# Altium project Altium_Design_Challenge.PrjPcb (part 1 of 3)
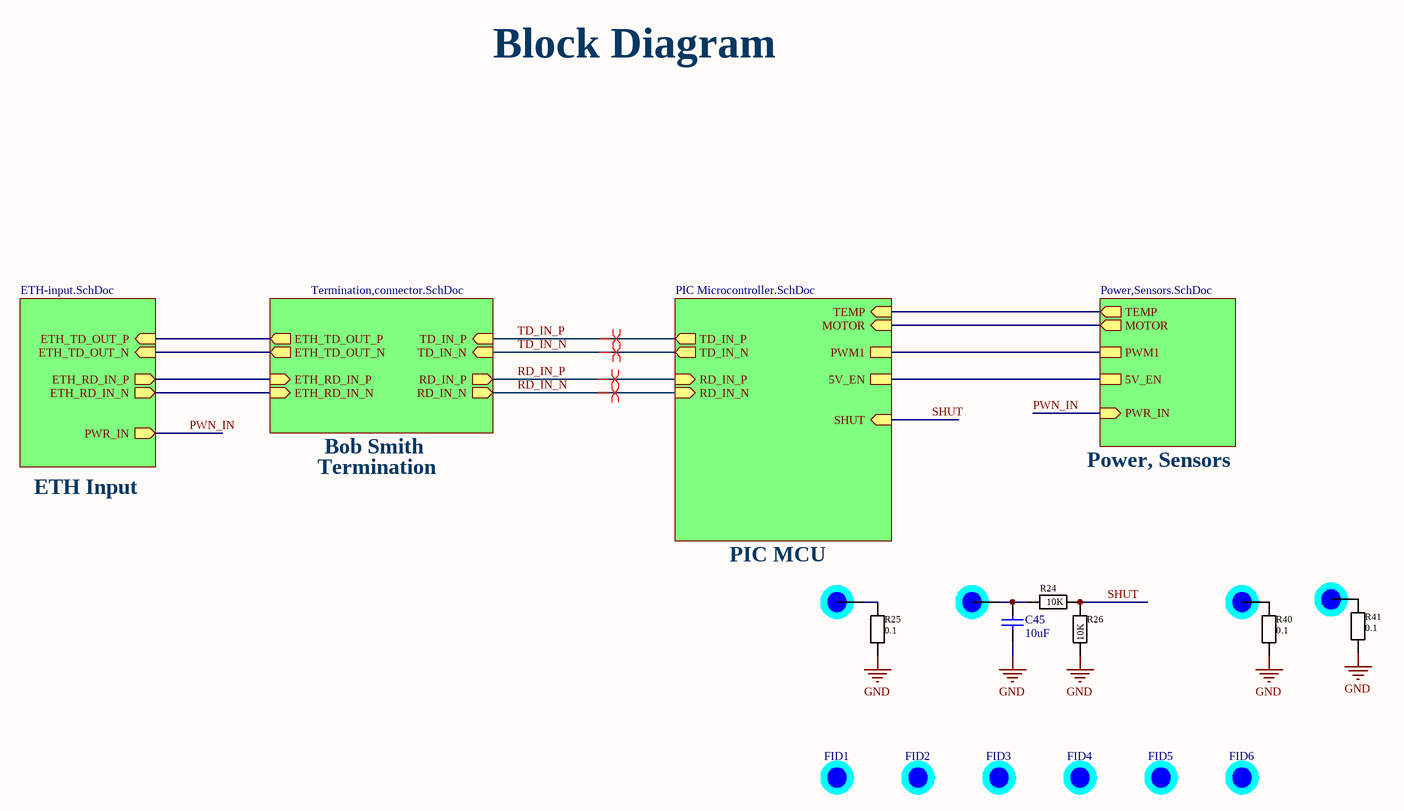
[diagram p0: Block Diagram.SchDoc]
5 sheets, 153 parts. Net scope: hierarchical (ports join the sheet entries above them; power ports are global).
Board file: AA-Design-Challenge_Muhammad.PcbDoc
Sheets:
  Block Diagram.SchDoc
    Designator = PIC Microcontroller.SchDoc
    Designator = Power,Sensors.SchDoc
    Designator = Termination,connector.SchDoc
    Designator = ETH-input.SchDoc

## Sheet Block Diagram.SchDoc: AA Design Challenge
size 431 x 279 mm; Revision: 1.0; SheetNumber: 1; SheetTotal: 4; ProjectName: TRK_GPRS_GNSS_BTLE

### Parts
C45  10uF  [CAPC1005X61USR]
FID1  Fiducial 1mm  [FIDUCIAL_1MM_RND]  (value not drawn)  (no BOM)
FID2  Fiducial 1mm  [FIDUCIAL_1MM_RND]  (value not drawn)  (no BOM)
FID3  Fiducial 1mm  [FIDUCIAL_1MM_RND]  (value not drawn)  (no BOM)
FID4  Fiducial 1mm  [FIDUCIAL_1MM_RND]  (value not drawn)  (no BOM)
FID5  Fiducial 1mm  [FIDUCIAL_1MM_RND]  (value not drawn)  (no BOM)
FID6  Fiducial 1mm  [FIDUCIAL_1MM_RND]  (value not drawn)  (no BOM)
MH1  MH_1.5mm  [MH_2mm]  (value not drawn)  (no BOM)
MH2  MH_1.5mm  [MH_2mm]  (value not drawn)  (no BOM)
MH3  MH_1.5mm  [MH_2mm]  (value not drawn)  (no BOM)
MH4  MH_1.5mm  [MH_2mm]  (value not drawn)  (no BOM)
R24  10K  [RESC1005X40USR]
R25  0.1  [RESC2012X65USR]
R26  10K  [RESC1005X40USR]
R40  0.1  [RESC2012X65USR]
R41  0.1  [RESC2012X65USR]

### Sub-sheets
Designator = PIC Microcontroller.SchDoc: TD_IN_P (out), TD_IN_N (out), RD_IN_P (in), RD_IN_N (in), TEMP (in), PWM1, 5V_EN, SHUT (in), MOTOR (in)
Designator = Power,Sensors.SchDoc: TEMP (out), PWM1, 5V_EN, MOTOR (out), PWR_IN (in)
Designator = Termination,connector.SchDoc: TD_IN_P (in), TD_IN_N (in), RD_IN_P (out), RD_IN_N (out), ETH_TD_OUT_P (out), ETH_TD_OUT_N (out), ETH_RD_IN_P (in), ETH_RD_IN_N (in)
Designator = ETH-input.SchDoc: ETH_TD_OUT_P (in), ETH_TD_OUT_N (in), ETH_RD_IN_P (out), ETH_RD_IN_N (out), PWR_IN (out)

### Nets
GND: C45.2 R25.1 R26.2 R40.1 R41.1
PWN_IN: sheet Designator/PWR_IN, sheet Designator/PWR_IN
RD_IN_N: sheet Designator/RD_IN_N, sheet Designator/RD_IN_N
RD_IN_P: sheet Designator/RD_IN_P, sheet Designator/RD_IN_P
RX_IN_N: sheet Designator/ETH_RD_IN_N, sheet Designator/ETH_RD_IN_N
RX_IN_P: sheet Designator/ETH_RD_IN_P, sheet Designator/ETH_RD_IN_P
SHUT: R24.2 R26.1 ; sheet Designator/SHUT
TD_IN_N: sheet Designator/TD_IN_N, sheet Designator/TD_IN_N
TD_IN_P: sheet Designator/TD_IN_P, sheet Designator/TD_IN_P
TX_IN_N: sheet Designator/ETH_TD_OUT_N, sheet Designator/ETH_TD_OUT_N
TX_IN_P: sheet Designator/ETH_TD_OUT_P, sheet Designator/ETH_TD_OUT_P
NetC21_2: sheet Designator/TEMP, sheet Designator/TEMP
NetC45_1: C45.1 MH2.1 R24.1
NetMH1_1: MH1.1 R25.2
NetMH3_1: MH3.1 R40.2
NetMH4_1: MH4.1 R41.2
NetR11_2: sheet Designator/PWM1, sheet Designator/PWM1
NetR13_1: sheet Designator/MOTOR, sheet Designator/MOTOR
NetR16_2: sheet Designator/5V_EN, sheet Designator/5V_EN

### Layout directives
differential pair: RD_IN_N, RD_IN_P, TD_IN_N, TD_IN_P

### Notes on the sheet
- Block Diagram
- Bob Smith
- ETH Input
- Termination
- Power, Sensors
- (near MH1) PIC MCU
- DWG. NO.
- REV.
- SHT.
- THIS DOCUMENT AND THE DATA DISCLOSED HEREIN OR HEREWITH IS THE PROPERTY OF ALTIUM LIMITED AND MAY BE FREELY DISTRIBUTED IN WHOLE. NO RIGHTS ARE RESERVED OR EXPRESS OR IMPLIED WARANTEE GIVEN.
- REVISION
- DESCRIPTION
- DATE
- APPROVED
- ENG:
- APPROVALS
- PROJECT
- DSN:
- CHK:
- REFERENCE DOCUMENTS
- PROJECT REVISION:
- TITLE
- DOCUMENT REVISION:
- DESIGN ITEM:
- BOM:
- FAB DWG:
- PCB DWG:
- ASSY DWG:
- SCALE:
- SIZE
- B
- CAGE CODE
- FILE NAME
- DWG NO.
- SHEET
- OF
- REV

### Library data of the parts
C45 = Cap: CAP CER 10UF 10V X5R 0402; Manufacturer: Samsung Electro-Mechanics; Manufacturer Part Number: CL05A106MP8NUB8; Supplier Part Number 1: 1276-6830-2-ND; Supplier Part Number 2: *; Supplier 1: *; Supplier 2: *; 100pc cost: *; 1pc cost: *; Height: *; value: 10uF
FID1-FID6 = FIDUCIAL_1MM_RND: Component Description: Fiducial 1mm
MH1-MH4 = MH_1.5mm: Component Description: Fiducial 1mm
R24 R26 = R: RES 10K OHM 1% 1/16W 0402; Manufacturer: Stackpole Electronics Inc; Manufacturer Part Number: RMCF0402FT10K0; Power Rating: 62.5mW; Tolerance: +/-1%; Voltage Rating: NA; Distributor: DigiKey; Value: 10K; Distributor Art. Nbr.: RMCF0402FT10K0TR-ND; Package: EIA-0402; Price Estim. @ 100pcs: 0.0049; Height: 0.40mm
R25 R40 R41 = R: RES 0.1 OHM 1% 1/8W 0805; Manufacturer: Yageo; Manufacturer Part Number: RL0805FR-070R1L; Tolerance: +/-1%; Voltage Rating: NA; Distributor: DigiKey; Value: 0.1; Distributor Art. Nbr.: 311-.10STR-ND; Package: EIA-0805; Height: 0.60mm

## Sheet PIC Microcontroller.SchDoc: AA Design Challenge
size 431 x 279 mm; Revision: 1.0; SheetNumber: 3; SheetTotal: 4; ProjectName: TRK_GPRS_GNSS_BTLE
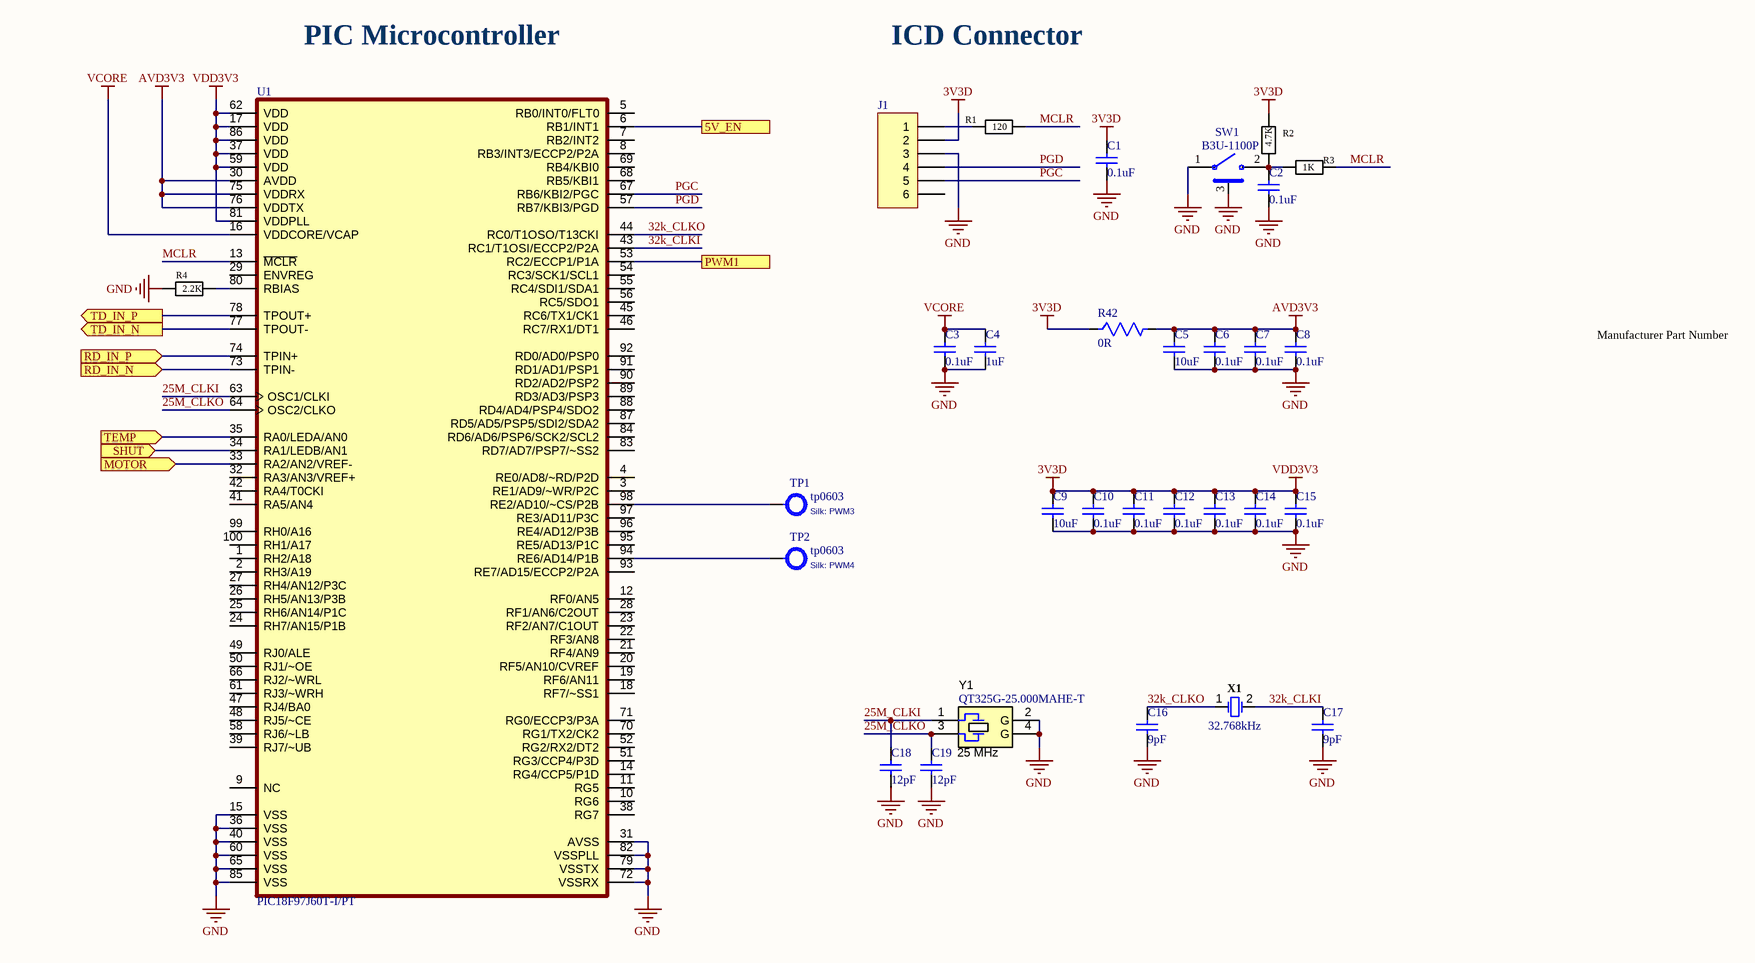
[diagram p1: PIC Microcontroller.SchDoc]

### Parts
C1  0.1uF  [CAPC1005X61USR]
C2  0.1uF  [CAPC1005X61USR]
C3  0.1uF  [CAPC1005X61USR]
C4  1uF  [CAPC1005X61USR]
C5  10uF  [CAPC1005X61USR]
C6  0.1uF  [CAPC1005X61USR]
C7  0.1uF  [CAPC1005X61USR]
C8  0.1uF  [CAPC1005X61USR]
C9  10uF  [CAPC1005X61USR]
C10  0.1uF  [CAPC1005X61USR]
C11  0.1uF  [CAPC1005X61USR]
C12  0.1uF  [CAPC1005X61USR]
C13  0.1uF  [CAPC1005X61USR]
C14  0.1uF  [CAPC1005X61USR]
C15  0.1uF  [CAPC1005X61USR]
C16  9pF  [CAPC1005X61USR]
C17  9pF  [CAPC1005X61USR]
C18  12pF  [CAPC1005X61USR]
C19  12pF  [CAPC1005X61USR]
J1  Header 6  [HDR1X6]  (value not drawn)  (no BOM)
R1  120  [RESC1005X40USR]
R2  4.7K  [RESC1005X40USR]
R3  1K  [RESC1005X40USR]
R4  2.2K  [RESC1005X40USR]
R42  0R  [R_0603]
SW1  B3U-1100P  [SW_B3U-1100P]
TP1  tp0603  Silk: PWM3  [TP 1mm]
TP2  tp0603  Silk: PWM4  [TP 1mm]
U1  PIC18F97J60T-I/PT  [QFP40P1400X1400X120-100N]
X1  32.768kHz  [XTAL_3215]
Y1  QT325G-25.000MAHE-T  Frequency_Fixed: 25 MHz  [XTAL_3225]

### Ports
5V_EN, MOTOR (in), PWM1, RD_IN_N (in), RD_IN_P (in), SHUT (in), TD_IN_N (out), TD_IN_P (out), TEMP (in)

### Nets
3V3D: C1.1 C9.1 C10.1 C11.1 C12.1 C13.1 C14.1 C15.1 J1.2 R2.1 R42.1 U1.17(VDD) U1.37(VDD) U1.59(VDD) U1.62(VDD) U1.81(VDDPLL) U1.86(VDD)  [also labelled VDD3V3]
AVD3V3: C5.1 C6.1 C7.1 C8.1 R42.2 U1.30(AVDD) U1.75(VDDRX) U1.76(VDDTX)
GND: C1.2 C2.2 C3.2 C4.1 C5.2 C6.2 C7.2 C8.2 C9.2 C10.2 C11.2 C12.2 C13.2 C14.2 C15.2 C16.2 C17.2 C18.2 C19.2 J1.3 R4.1 SW1.1 SW1.3 U1.15(VSS) U1.31(AVSS) U1.36(VSS) U1.40(VSS) U1.60(VSS) U1.65(VSS) U1.72(VSSRX) U1.79(VSSTX) U1.82(VSSPLL) U1.85(VSS) Y1.2(GND) Y1.4(GND)
VCORE: C3.1 C4.2 U1.16(VDDCORE/VCAP)
25M_CLKI: C18.1 U1.63(OSC1/CLKI) Y1.1
25M_CLKO: C19.1 U1.64(OSC2/CLKO) Y1.3
32k_CLKI: C17.1 U1.43(RC1/T1OSI/ECCP2/P2A) X1.2
32k_CLKO: C16.1 U1.44(RC0/T1OSO/T13CKI) X1.1
MCLR: R1.2 R3.2 U1.13(~{MCLR})
PGC: J1.5 U1.67(RB6/KBI2/PGC)
PGD: J1.4 U1.57(RB7/KBI3/PGD)
RD_IN_N: U1.73(TPIN-) ; port RD_IN_N
RD_IN_P: U1.74(TPIN+) ; port RD_IN_P
SHUT: U1.34(RA1/LEDB/AN1) ; port SHUT
TD_IN_N: U1.77(TPOUT-) ; port TD_IN_N
TD_IN_P: U1.78(TPOUT+) ; port TD_IN_P
NetC2_1: C2.1 R2.2 R3.1 SW1.2
NetC21_2: U1.35(RA0/LEDA/AN0) ; port TEMP
NetJ1_1: J1.1 R1.1
NetR4_2: R4.2 U1.80(RBIAS)
NetR11_2: U1.53(RC2/ECCP1/P1A) ; port PWM1
NetR13_1: U1.33(RA2/AN2/VREF-) ; port MOTOR
NetR16_2: U1.6(RB1/INT1) ; port 5V_EN
NetTP1_1: TP1.1 U1.98(RE2/AD10/~CS/P2B)
NetTP2_1: TP2.1 U1.94(RE6/AD14/P1B)

Not connected (* = marked no-connect by the designer): J1 6; U1 1(RH2/A18) 2(RH3/A19) 3(RE1/AD9/~WR/P2C) 4(RE0/AD8/~RD/P2D) 5(RB0/INT0/FLT0) 7(RB2/INT2) 8(RB3/INT3/ECCP2/P2A) 9(NC) 10(RG6) 11(RG5) 12(RF0/AN5) 14(RG4/CCP5/P1D) 18(RF7/~SS1) 19(RF6/AN11) 20(RF5/AN10/CVREF) 21(RF4/AN9) 22(RF3/AN8) 23(RF2/AN7/C1OUT) 24(RH7/AN15/P1B) 25(RH6/AN14/P1C) 26(RH5/AN13/P3B) 27(RH4/AN12/P3C) 28(RF1/AN6/C2OUT) 29(ENVREG) 32(RA3/AN3/VREF+) 38(RG7) 39(RJ7/~UB) 41(RA5/AN4) 42(RA4/T0CKI) 45(RC6/TX1/CK1) 46(RC7/RX1/DT1) 47(RJ4/BA0) 48(RJ5/~CE) 49(RJ0/ALE) 50(RJ1/~OE) 51(RG3/CCP4/P3D) 52(RG2/RX2/DT2) 54(RC3/SCK1/SCL1) 55(RC4/SDI1/SDA1) 56(RC5/SDO1) 58(RJ6/~LB) 61(RJ3/~WRH) 66(RJ2/~WRL) 68(RB5/KBI1) 69(RB4/KBI0) 70(RG1/TX2/CK2) 71(RG0/ECCP3/P3A) 83(RD7/AD7/PSP7/~SS2) 84(RD6/AD6/PSP6/SCK2/SCL2) 87(RD5/AD5/PSP5/SDI2/SDA2) 88(RD4/AD4/PSP4/SDO2) 89(RD3/AD3/PSP3) 90(RD2/AD2/PSP2) 91(RD1/AD1/PSP1) 92(RD0/AD0/PSP0) 93(RE7/AD15/ECCP2/P2A) 95(RE5/AD13/P1C) 96(RE4/AD12/P3B) 97(RE3/AD11/P3C) 99(RH0/A16) 100(RH1/A17)

### Notes on the sheet
- PIC Microcontroller
- ICD Connector
- Manufacturer Part Number
- DWG. NO.
- REV.
- SHT.
- THIS DOCUMENT AND THE DATA DISCLOSED HEREIN OR HEREWITH IS THE PROPERTY OF ALTIUM LIMITED AND MAY BE FREELY DISTRIBUTED IN WHOLE. NO RIGHTS ARE RESERVED OR EXPRESS OR IMPLIED WARANTEE GIVEN.
- REVISION
- DESCRIPTION
- DATE
- APPROVED
- ENG:
- APPROVALS
- PROJECT
- DSN:
- CHK:
- REFERENCE DOCUMENTS
- PROJECT REVISION:
- TITLE
- DOCUMENT REVISION:
- DESIGN ITEM:
- BOM:
- FAB DWG:
- PCB DWG:
- ASSY DWG:
- SCALE:
- SIZE
- B
- CAGE CODE
- FILE NAME
- DWG NO.
- SHEET
- OF
- REV
- (in symbol ABM8AIG-25.000MHZ-12-2Z-T3) G

### Library data of the parts
C1-C3 C6-C8 C10-C15 = Cap: CAP CER 0.1UF 50V X7R 0402; Manufacturer: TDK Corporation; Manufacturer Part Number: CGA2B3X7R1H104K050BB; Supplier Part Number 1: 445-6899-2-ND; Supplier Part Number 2: *; Supplier 1: *; Supplier 2: *; 100pc cost: *; 1pc cost: *; Height: *; value: 0.1uF
C4 = Cap: CAP CER 1UF 16V X5R 0402; Manufacturer: Samsung Electro-Mechanics; Manufacturer Part Number: CL05A105KO5NNNC; Supplier Part Number 1: 1276-1067-2-ND; Supplier Part Number 2: *; Supplier 1: *; Supplier 2: *; 100pc cost: *; 1pc cost: *; Height: *; value: 1uF
C5 C9 = Cap: as C45 on sheet Block Diagram; Supplier Part Number 1: 1276-6830-2-ND; Supplier Part Number 2: *; Supplier 1: *; Supplier 2: *; 100pc cost: *; 1pc cost: *; Height: *; value: 10uF
C16 C17 = Cap: CAP CER 9PF 50V C0G/NPO 0402; Manufacturer: Yageo; Manufacturer Part Number: CC0402BRNPO9BN9R0; Supplier Part Number 1: 311-1629-2-ND; Supplier Part Number 2: *; Supplier 1: *; Supplier 2: *; 100pc cost: *; 1pc cost: *; Height: *; value: 9pF
C18 C19 = Cap: CAP CER 12PF 50V C0G 0402; Manufacturer: TDK Corporation; Manufacturer Part Number: CGA2B2C0G1H120J050BA; Supplier Part Number 1: 445-5585-2-ND; Supplier Part Number 2: *; Supplier 1: *; Supplier 2: *; 100pc cost: *; 1pc cost: *; Height: *; value: 12pF
J1 = Header 6: Header, 6-Pin; LatestRevisionDate: 17-Jul-2002; LatestRevisionNote: Re-released for DXP Platform.; Publisher: Altium Limited
R1 = R: RES SMD 120 OHM 1% 1/16W 0402; Manufacturer: Yageo; Manufacturer Part Number: RC0402FR-07120RL; Power Rating: 62.5mW; Tolerance: +/-1%; Voltage Rating: NA; Distributor: DigiKey; Value: 120; Distributor Art. Nbr.: 311-120LRTR-ND; Package: EIA-0402; Price Estim. @ 100pcs: 0.0049; Height: 0.40mm
R2 = R: RES SMD 4.7K OHM 1% 1/16W 0402; Manufacturer: Yageo; Manufacturer Part Number: RC0402FR-074K7L; Power Rating: 62.5mW; Tolerance: +/-1%; Voltage Rating: NA; Distributor: DigiKey; Value: 4.7K; Distributor Art. Nbr.: 311-4.7KLRTR-ND; Package: EIA-0402; Price Estim. @ 100pcs: 0.0049; Height: 0.40mm
R3 = R: RES SMD 1K OHM 1% 1/16W 0402; Manufacturer: Yageo; Manufacturer Part Number: RC0402FR-071KL; Power Rating: 62.5mW; Tolerance: +/-1%; Voltage Rating: NA; Distributor: DigiKey; Value: 1K; Distributor Art. Nbr.: 311-1.00KLRTR-ND; Package: EIA-0402; Price Estim. @ 100pcs: 0.0049; Height: 0.40mm
R4 = R: RES SMD 2.2K OHM 1% 1/16W 0402; Manufacturer: Yageo; Manufacturer Part Number: RC0402FR-072K2L; Power Rating: 62.5mW; Tolerance: +/-1%; Voltage Rating: NA; Distributor: DigiKey; Value: 2.2K; Distributor Art. Nbr.: 311-2.20KLRTR-ND; Package: EIA-0402; Price Estim. @ 100pcs: 0.0049; Height: 0.40mm
R42 = Res 0R 1/10W 0603: Fixed Resistor, Metal Glaze/thick Film, 0.1W, 0ohm, Surface Mount, 0603; Manufacturer: Yageo; Manufacturer Part Number: RC0603FR-070RL; Rated Power Dissipation (P): 100mW; Rated Temperature: 70°C; Supplier 1: Mouser; Supplier Part Number 1: 603-RC0603FR-070RL; RoHS: Yes; Category: Chip SMD Resistors; Stock 1: 4979913; Pricing 1: 1=0.10000, 10=0.01200, 50=0.01200, 100=0.00900, 1000=0.00500, 10000=0.00300 (USD); Mount: Surface Mount; Number of Pins: 2; Package Shape: Rectangular; Size Code: 0603; Terminal Finish: Nickel; Min Operating Temperature: -55°C; Max Operating Temperature: 155°C; JESD-609 Code: e3; Resistor Type: FIXED RESISTOR; Packaging: Tape and Reel; Resistance: 0R; Termination: Wraparound; Technology: METAL GLAZE/THICK FILM; REACH SVHC: Yes; RoHS Compliant: Yes; ComponentLink1URL: https://datasheet.ciiva.com:443/pdfs/VipMasterIC/IC/YAGO/YAGOS02869/YAGOS02869-1.pdf?src-supplier=IHS+Markit; ComponentLink1Description: https://datasheet.ciiva.com:443/pdfs/VipMasterIC/IC/YAGO/YAGOS02869/YAGOS02869-1.pdf?src-supplier=IHS+Markit; ComponentLink2URL: https://datasheet.ciiva.com/11808/0900766b80f96399-11808172.pdf?src-supplier=RSComponents; ComponentLink2Description: https://datasheet.ciiva.com/11808/0900766b80f96399-11808172.pdf?src-supplier=RSComponents; ComponentLink3URL: https://datasheet.ciiva.com/5684/443971-5684699.pdf?src-supplier=Farnell; ComponentLink3Description: https://datasheet.ciiva.com/5684/443971-5684699.pdf?src-supplier=Farnell; ComponentLink4URL: https://datasheet.ciiva.com/7983/443971-7983627.pdf?src-supplier=Element14; ComponentLink4Description: https://datasheet.ciiva.com/7983/443971-7983627.pdf?src-supplier=Element14; ComponentLink5URL: https://datasheet.ciiva.com/22643/1868787-22643388.pdf?src-supplier=Element14; ComponentLink5Description: https://datasheet.ciiva.com/22643/1868787-22643388.pdf?src-supplier=Element14; ComponentLink6URL: https://datasheet.ciiva.com/46382/443971-46382072.pdf?src-supplier=Element14; ComponentLink6Description: https://datasheet.ciiva.com/46382/443971-46382072.pdf?src-supplier=Element14; ComponentLink7URL: https://datasheet.ciiva.com/29721/pyu-r-int-thick-7-29721178.pdf?src-supplier=Digi-Key; ComponentLink7Description: https://datasheet.ciiva.com/29721/pyu-r-int-thick-7-29721178.pdf?src-supplier=Digi-Key; ComponentLink8URL: https://datasheet.ciiva.com/29721/pyu-rc0603-51-rohs-l-4-29721179.pdf?src-supplier=Digi-Key; ComponentLink8Description: https://datasheet.ciiva.com/29721/pyu-rc0603-51-rohs-l-4-29721179.pdf?src-supplier=Digi-Key; ComponentLink9URL: https://datasheet.ciiva.com/5558/rc0603-272842-5558341.pdf?src-supplier=Mouser; ComponentLink9Description: https://datasheet.ciiva.com/5558/rc0603-272842-5558341.pdf?src-supplier=Mouser
SW1 = B3U-1100P: SWITCH TACTILE SPST-NO 0.05A 12V; Manufacturer: Omron; Package: None; Supplier Part Number 1: SW1021TR-ND; Manufacturer Part Number: B3U-1100P; Price: None
TP1 TP2 = Testpkt0603: Part Number: 4001364; Mount option: Not Mounted; ALT_SYMBOL: tp0603_wave; Device_class: DISCRETE; Part Type: TP; PCB Footprint: tp0603
U1 = PIC18F97J60T-I/PT: IC MCU 8BIT 128KB FLASH 100TQFP (12x12); Manufacturer: Microchip; Availability: Unavailable; Price: None; Digi-Key Part Number: PIC18F97J60T-I/PTTR-ND; Value: *; Manufacturer Product Number: PIC18F97J60T-I/PT; Package: TQFP-100 Microchip; BuyPart: PIC18F97J60T-I/PT
X1 = XTAL-1-2-2: CRYSTAL 32.7680KHZ 9PF SMD; Manufacturer: EPSON; Manufacturer Part Number: FC-135 32.7680KA-AC0; Supplier Part Number 1: SER4084TR-ND; Package: 2-SMD(3215); Supplier 1: Digi-Key; Height: 0.90mm; value: 32.768kHz
Y1 = ABM8AIG-25.000MHZ-12-2Z-T3: CRYSTAL 25.0000MHZ 12PF SMD; Manufacturer: QST; Frequency Stability: ±30ppm; Manufacturer Part Number: QT325G-25.000MAHE-T; CompType: Crystal; PackageReference: 3.2x2.5mm; MountType: SMT; ComponentLink1Description: Datasheet Link; ComponentLink1URL: http://www.abracon.com/AIGcrystals/ABM8AIG.pdf; Supplier Part Number 1: 2388-SXT32412AA16-25.000MTR-ND

## Sheet Power,Sensors.SchDoc: AA Design Challenge
size 431 x 279 mm; Revision: 1.0; SheetNumber: 4; SheetTotal: 4; ProjectName: TRK_GPRS_GNSS_BTLE
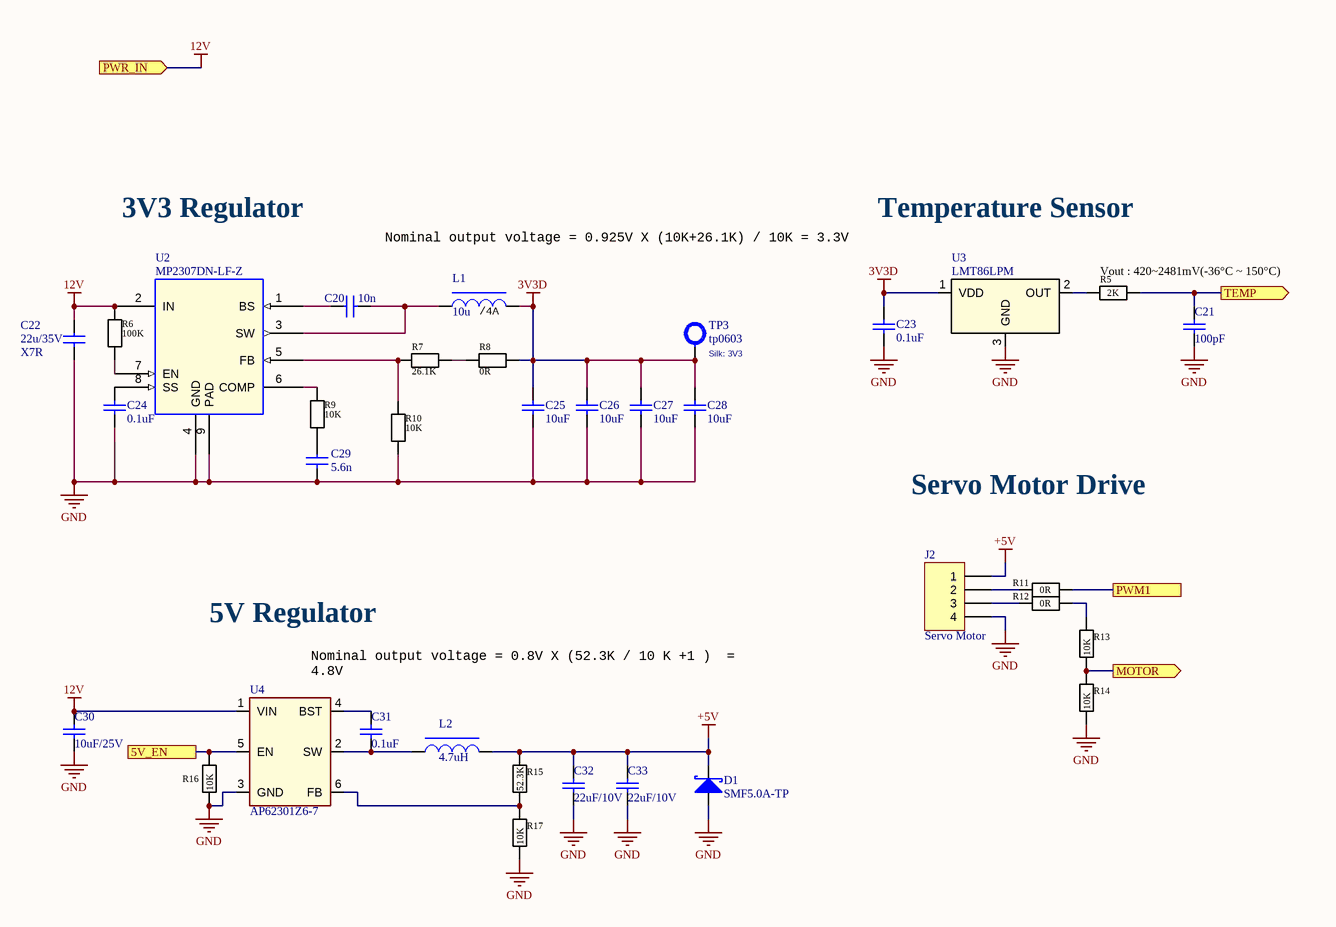
[diagram p2: Power,Sensors.SchDoc]

### Parts
C20  10n  [CAPC1005X55USR]
C21  100pF  [CAPC1005X61USR]
C22  22u/35V  material: X7R  [CAPC3216X175USR]
C23  0.1uF  [CAPC1005X61USR]
C24  0.1uF  [CAPC1005X61USR]
C25  10uF  [CAPC1005X61USR]
C26  10uF  [CAPC1005X61USR]
C27  10uF  [CAPC1005X61USR]
C28  10uF  [CAPC1005X61USR]
C29  5.6n  [CAPC1005X55USR]
C30  10uF/25V  [CAPC2012X145USR]
C31  0.1uF  [CAPC1005X61USR]
C32  22uF/10V  [CAPC2012X145USR]
C33  22uF/10V  [CAPC2012X145USR]
D1  SMF5.0A-TP  [SOD123FL]
J2  Servo Motor  [4 pin 2.54 mm Breakaway]  (no BOM)
L1  10u  [IND_0630CDMCCDS_SUM]
L2  4.7uH  [IND_NR5040]
R5  2K  [RESC1005X40USR]
R6  100K  [RESC1005X40USR]
R7  26.1K  [RESC1005X40USR]
R8  0R  [RESC1005X40USR]
R9  10K  [RESC1005X40USR]
R10  10K  [RESC1005X40USR]
R11  0R  [RESC1005X40USR]
R12  0R  [RESC1005X40USR]
R13  10K  [RESC1005X40USR]
R14  10K  [RESC1005X40USR]
R15  52.3K  [RESC1005X40USR]
R16  10K  [RESC1005X40USR]
R17  10K  [RESC1005X40USR]
TP3  tp0603  Silk: 3V3  [TP 1mm]
U2  MP2307DN-LF-Z  [SOIC127P600X175-9N]
U3  LMT86LPM  [LP3_TEX]
U4  AP62301Z6-7  [SOT563]

### Ports
5V_EN, MOTOR (out), PWM1, PWR_IN (in), TEMP (out)

### Nets
3V3D: C23.1 C25.1 C26.1 C27.1 C28.1 L1.2 R8.2 TP3.1 U3.1(VDD)
12V: C22.1 C30.1 R6.1 U2.2(IN) U4.1(VIN) ; port PWR_IN  [project net PWN_IN]
+5V: C32.1 C33.1 D1.C J2.1 L2.2 R15.2
GND: C21.1 C22.2 C23.2 C24.2 C25.2 C26.2 C27.2 C28.2 C29.2 C30.2 C32.2 C33.2 D1.A J2.4 R10.2 R14.1 R16.1 R17.1 U2.4(GND) U2.9(PAD) U3.3(GND) U4.3(GND)
NetC20_1: C20.1 U2.1(BS)
NetC20_2: C20.2 L1.1 U2.3(SW)
NetC21_2: C21.2 R5.2 ; port TEMP
NetC24_1: C24.1 U2.8(SS)
NetC29_1: C29.1 R9.2
NetC31_1: C31.1 U4.4(BST)
NetC31_2: C31.2 L2.1 U4.2(SW)
NetJ2_2: J2.2 R11.1
NetJ2_3: J2.3 R12.1
NetR5_1: R5.1 U3.2(OUT)
NetR6_2: R6.2 U2.7(EN)
NetR7_1: R7.1 R10.1 U2.5(FB)
NetR7_2: R7.2 R8.1
NetR9_1: R9.1 U2.6(COMP)
NetR11_2: R11.2 ; port PWM1
NetR12_2: R12.2 R13.2
NetR13_1: R13.1 R14.2 ; port MOTOR
NetR15_1: R15.1 R17.2 U4.6(FB)
NetR16_2: R16.2 U4.5(EN) ; port 5V_EN

### Notes on the sheet
- 3V3 Regulator
- Nominal output voltage = 0.925V X (10K+26.1K) / 10K = 3.3V
- Temperature Sensor
- (near L1) /4A
- (near R5) Vout : 420~2481mV(-36°C ~ 150°C)
- Servo Motor Drive
- 5V Regulator
- Nominal output voltage = 0.8V X (52.3K / 10 K +1 )  = 4.8V
- DWG. NO.
- REV.
- SHT.
- THIS DOCUMENT AND THE DATA DISCLOSED HEREIN OR HEREWITH IS THE PROPERTY OF ALTIUM LIMITED AND MAY BE FREELY DISTRIBUTED IN WHOLE. NO RIGHTS ARE RESERVED OR EXPRESS OR IMPLIED WARANTEE GIVEN.
- REVISION
- DESCRIPTION
- DATE
- APPROVED
- ENG:
- APPROVALS
- PROJECT
- DSN:
- CHK:
- REFERENCE DOCUMENTS
- PROJECT REVISION:
- TITLE
- DOCUMENT REVISION:
- DESIGN ITEM:
- BOM:
- FAB DWG:
- PCB DWG:
- ASSY DWG:
- SCALE:
- SIZE
- B
- CAGE CODE
- FILE NAME
- DWG NO.
- SHEET
- OF
- REV

### Library data of the parts
C20 = capacitor: CAP CER 10000PF 25V X7R 0402; Manufacturer: Murata Electronics; Manufacturer Product Number: GRM155R71E103JA01J; value_fp: 0; Max_Power: W; Device_class: DISCRETE; PCB Footprint: 0402; Digi-Key Part Number: 490-6340-2-ND; Part Type: C; Signal_model: capacitor
C21 = Cap: CAP CER 100PF 50V C0G/NP0 0402; Manufacturer: Murata Electronics; Manufacturer Part Number: GCM1555C1H101FA16D; Supplier Part Number 1: 490-14349-2-ND; Supplier Part Number 2: *; Supplier 1: *; Supplier 2: *; 100pc cost: *; 1pc cost: *; Height: *; value: 100pF
C22 = capacitor: CAP CER 22UF 35V JB 1206; Manufacturer Part Number: C3216JB1V226M160AC; Manufacturer: TDK Corporation; PCB Footprint: 1206; Supplier Part Number 1: 445-11739-2-ND; Part Type: C; Supplier 1: Digi-Key
C23 C24 C31 = Cap: as C1 on sheet PIC Microcontroller; Supplier Part Number 1: 445-6899-2-ND; Supplier Part Number 2: *; Supplier 1: *; Supplier 2: *; 100pc cost: *; 1pc cost: *; Height: *; value: 0.1uF
C25-C28 = Cap: as C45 on sheet Block Diagram; Supplier Part Number 1: 1276-6830-2-ND; Supplier Part Number 2: *; Supplier 1: *; Supplier 2: *; 100pc cost: *; 1pc cost: *; Height: *; value: 10uF
C29 = capacitor: CAP CER 5600PF 50V X7R 0402; Manufacturer: Murata Electronics; Manufacturer Product Number: GRM155R71H562KA88D; value_fp: 0; Max_Power: W; tolerance: 10%; ALT_SYMBOL: 0603_wave; Device_class: DISCRETE; PCB Footprint: 0402; Digi-Key Part Number: 490-6364-2-ND; Part Type: C; Signal_model: capacitor
C30 = Cap: CAP CER 10UF 25V X5R 0805; Manufacturer: TDK Corporation; Manufacturer Part Number: C2012X5R1E106K125AB; Supplier Part Number 1: 445-5984-2-ND; Supplier Part Number 2: *; Supplier 1: *; Supplier 2: *; 100pc cost: *; 1pc cost: *; Height: *; value: 10uF/25V
C32 C33 = Cap: CAP CER 22UF 10V X5R 0805; Manufacturer: Samsung; Manufacturer Part Number: CL21A226KPCLRNC; Supplier Part Number 1: 1276-6786-2-ND; Supplier Part Number 2: *; Supplier 1: *; Supplier 2: *; 100pc cost: *; 1pc cost: *; Height: *; value: 22uF/10V
D1 = SMF5.0A-TP: TVS DIODE 5VWM 9.2VC SOD123FL; Manufacturer: Micro Commercial Co; Trr (ns): 5; ComponentLink2URL: http://www.nxp.com/documents/data_sheet/BAT54_SER.pdf; Manufacturer Part Number: SMF5.0A-TP; ComponentLink2Description: Datasheet; PackageReference: SOT123FL; Mounting Technology: Surface Mount; ComponentLink1URL: http://www.nxp.com/; ComponentLink1Description: Manufacturer URL; Supplier Part Number 1: SMF5.0A-TPMSTR-ND; Supplier 1: Digi-Key
J2 = Header 4: Header, 4-Pin
L1 = inductor: FIXED IND 10UH 4A 67 MOHM SMD; Manufacturer: Sumida America Components Inc.; Manufacturer Part Number: 0630CDMCCDS-100MC; Device_class: DISCRETE; Voltage: V; tolerance: 20%; Max_Power: 4W; Digi-Key Part Number: 308-2459-2-ND; Part Type: L
L2 = inductor: FIXED IND 4.7UH 3.1A 37.7MOHM SM; Manufacturer: Taiyo Yuden; Manufacturer Part Number: NR5040T4R7N; Digi-Key Part Number: 587-2373-2-ND; Part Number: NR5040T4R7N
R5 = R: RES SMD 2K OHM 1% 1/16W 0402; Manufacturer: Yageo; Manufacturer Part Number: RC0402FR-072KL; Power Rating: 62.5mW; Tolerance: +/-1%; Voltage Rating: NA; Distributor: DigiKey; Value: 2K; Distributor Art. Nbr.: 311-2KLRTR-ND; Package: EIA-0402; Price Estim. @ 100pcs: 0.0049; Height: 0.40mm
R6 = R: RES SMD 100K OHM 1% 1/16W 0402; Manufacturer: Yageo; Manufacturer Part Number: RC0402FR-07100KL; Power Rating: 62.5mW; Tolerance: +/-1%; Voltage Rating: NA; Distributor: DigiKey; Value: 100K; Distributor Art. Nbr.: 311-100KLRTR-ND; Package: EIA-0402; Price Estim. @ 100pcs: 0.0049; Height: 0.40mm
R7 = R: RES SMD 26.1K OHM 1% 1/5W 0402; Manufacturer: Vishay Dale; Manufacturer Part Number: CRCW040226K1FKEDHP; Power Rating: 62.5mW; Tolerance: +/-1%; Voltage Rating: NA; Distributor: DigiKey; Value: 26.1K; Distributor Art. Nbr.: 541-26.1KYTR-ND; Package: EIA-0402; Price Estim. @ 100pcs: 0.0049; Height: 0.40mm
R8 R11 R12 = R: RES SMD 0 OHM JUMPER 1/16W 0402; Manufacturer: Yageo; Manufacturer Part Number: RC0402FR-070RL; Power Rating: 62.5mW; Tolerance: +/-1%; Voltage Rating: NA; Distributor: DigiKey; Value: 0R; Distributor Art. Nbr.: 311-0.0LRTR-ND; Package: EIA-0402; Price Estim. @ 100pcs: 0.0049; Height: 0.40mm
R9 R10 = R: as R24 on sheet Block Diagram; Distributor: DigiKey; Value: 10K; Distributor Art. Nbr.: RMCF0402FT10K0TR-ND; Package: EIA-0402; Price Estim. @ 100pcs: 0.0049; Height: 0.40mm
R13 R14 R16 R17 = R: RES SMD 10K OHM 1% 1/16W 0402; Manufacturer: Yageo; Manufacturer Part Number: RC0402FR-0710KL; Power Rating: 62.5mW; Tolerance: +/-1%; Voltage Rating: NA; Distributor: DigiKey; Value: 10K; Package: EIA-0402; Price Estim. @ 100pcs: 0.0049; Height: 0.40mm
  R13 R14: Distributor Part Number: 311-10.0KLRTR-ND
  R16 R17: Distributor Art. Nbr.: 311-10.0KLRTR-ND
R15 = R: RES SMD 52.3K OHM 1% 1/16W 0402; Manufacturer: Yageo; Manufacturer Part Number: RC0402FR-0752K3L; Power Rating: 62.5mW; Tolerance: +/-1%; Voltage Rating: NA; Distributor: DigiKey; Value: 52.3K; Distributor Art. Nbr.: YAG3179TR-ND; Package: EIA-0402; Price Estim. @ 100pcs: 0.0049; Height: 0.40mm
TP3 = Testpkt0603: as TP1 on sheet PIC Microcontroller; Part Type: TP; PCB Footprint: tp0603
U2 = MP2307: IC REG BUCK ADJUSTABLE 3A 8SOIC; Manufacturer: Monolithic Power Systems Inc.; Value_fp: 0.71; PCB Footprint: so08-EDP-2; Device_class: IC; Digi-Key Part Number: 1589-1576-2-ND; Manufacturer's Part Number: MP2307DN-LF-Z; Part Number: MP2307DN-LF-Z
U3 = LMT86LPM: SENSOR ANALOG -50C-150C TO92-3; Manufacturer: Texas Instruments; SourceLibrary: TI_2019-03-25_5; Manufacturer Part Number: LMT86LPM; Digi-Key Part Number: 296-46127-1-ND; Copyright: Copyright (C) 2018 Accelerated Designs. All rights reserved; RefDes: RefDes; Type: DEV
U4 = TPS563207SDRLR: DCDC CONV HV BUCK SOT563 T&R 3K; Manufacturer: Diodes Incorporated; Geometry.Height: 0.6mm; Manufacturer Part Number: AP62301Z6-7; Digi-Key Part Number: 31-AP62301Z6-7TR-ND

## Sheet Termination,connector.SchDoc: AA Design Challenge
size 431 x 279 mm; Revision: 1.0; SheetNumber: 2; SheetTotal: 4; ProjectName: TRK_GPRS_GNSS_BTLE
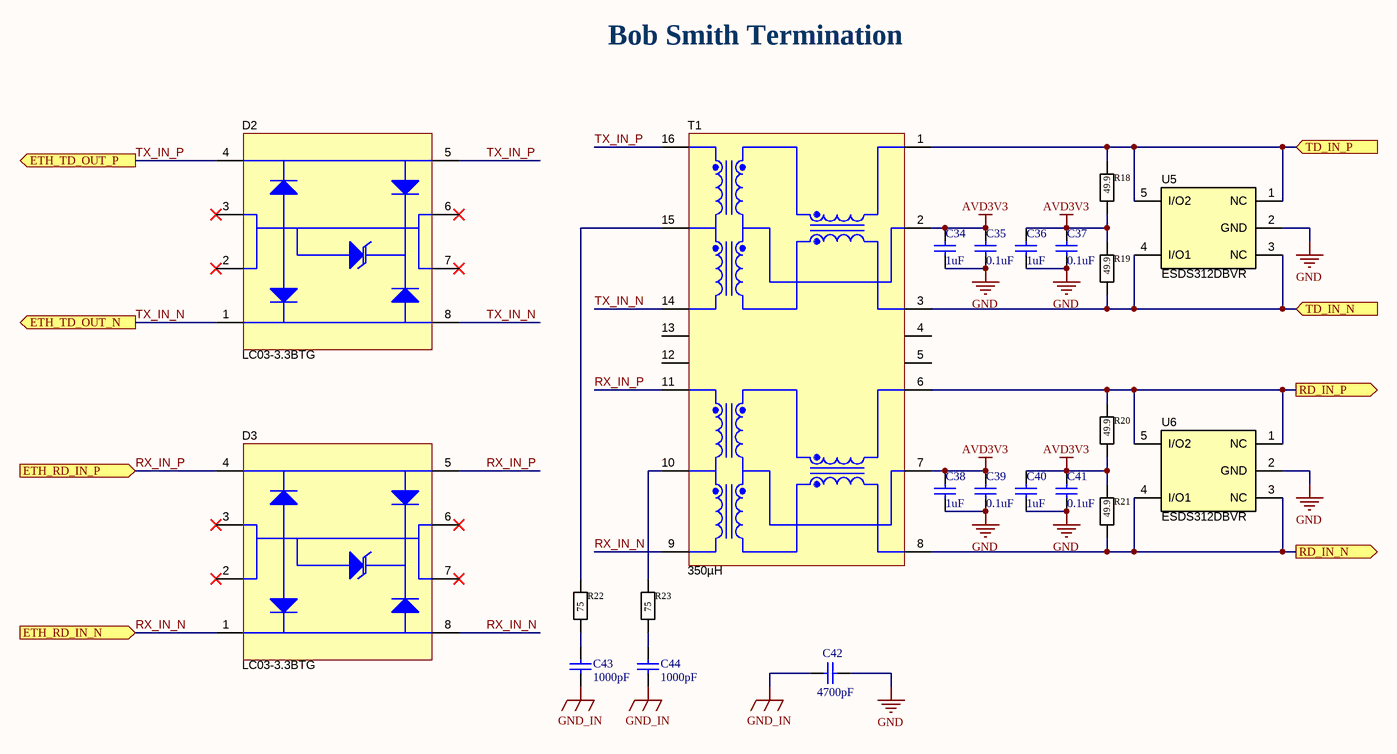
[diagram p3: Termination,connector.SchDoc]

### Parts
C34  1uF  [CAPC1005X61USR]
C35  0.1uF  [CAPC1005X61USR]
C36  1uF  [CAPC1005X61USR]
C37  0.1uF  [CAPC1005X61USR]
C38  1uF  [CAPC1005X61USR]
C39  0.1uF  [CAPC1005X61USR]
C40  1uF  [CAPC1005X61USR]
C41  0.1uF  [CAPC1005X61USR]
C42  4700pF  [CAPC4532X200N]
C43  1000pF  [CAPC1005X61USR]
C44  1000pF  [CAPC1005X61USR]
D2  LC03-3.3BTG  [SOIC127P600X175-8N]
D3  LC03-3.3BTG  [SOIC127P600X175-8N]
R18  49.9  [RESC1005X40USR]
R19  49.9  [RESC1005X40USR]
R20  49.9  [RESC1005X40USR]
R21  49.9  [RESC1005X40USR]
R22  75  [RESC1005X40USR]
R23  75  [RESC1005X40USR]
T1  ValueDisplayed: 350µH  [HX1198FNLT_PUL]
U5  ESDS312DBVR  [SOT23-5]
U6  ESDS312DBVR  [SOT23-5]

### Ports
ETH_RD_IN_N (in), ETH_RD_IN_P (in), ETH_TD_OUT_N (out), ETH_TD_OUT_P (out), RD_IN_N (out), RD_IN_P (out), TD_IN_N (in), TD_IN_P (in)

### Nets
AVD3V3: C34.2 C35.1 C36.2 C37.1 C38.2 C39.1 C40.2 C41.1 R18.2 R19.1 R20.2 R21.1 T1.2(TCT) T1.7(RCT)
GND: C34.1 C35.2 C36.1 C37.2 C38.1 C39.2 C40.1 C41.2 C42.1 U5.2(GND) U6.2(GND)
GND_IN: C42.2 C43.1 C44.1
RD_IN_N: R21.2 T1.8(RD-) U6.3(NC) U6.4(I/O1) ; port RD_IN_N
RD_IN_P: R20.1 T1.6(RD+) U6.1(NC) U6.5(I/O2) ; port RD_IN_P
RX_IN_N: D3.1 D3.8 T1.9(RX-) ; port ETH_RD_IN_N
RX_IN_P: D3.4 D3.5 T1.11(RX+) ; port ETH_RD_IN_P
TD_IN_N: R19.2 T1.3(TD-) U5.3(NC) U5.4(I/O1) ; port TD_IN_N
TD_IN_P: R18.1 T1.1(TD+) U5.1(NC) U5.5(I/O2) ; port TD_IN_P
TX_IN_N: D2.1 D2.8 T1.14(TX-) ; port ETH_TD_OUT_N
TX_IN_P: D2.4 D2.5 T1.16(TX+) ; port ETH_TD_OUT_P
NetC43_2: C43.2 R22.2
NetC44_2: C44.2 R23.2
NetR22_1: R22.1 T1.15(CMT)
NetR23_1: R23.1 T1.10(CMT)

Not connected (* = marked no-connect by the designer): D2 2* 3* 6* 7*; D3 2* 3* 6* 7*; T1 4(NC) 5(NC) 12(NC) 13(NC)

### Notes on the sheet
- Bob Smith Termination
- DWG. NO.
- REV.
- SHT.
- THIS DOCUMENT AND THE DATA DISCLOSED HEREIN OR HEREWITH IS THE PROPERTY OF ALTIUM LIMITED AND MAY BE FREELY DISTRIBUTED IN WHOLE. NO RIGHTS ARE RESERVED OR EXPRESS OR IMPLIED WARANTEE GIVEN.
- REVISION
- DESCRIPTION
- DATE
- APPROVED
- ENG:
- APPROVALS
- PROJECT
- DSN:
- CHK:
- REFERENCE DOCUMENTS
- PROJECT REVISION:
- TITLE
- DOCUMENT REVISION:
- DESIGN ITEM:
- BOM:
- FAB DWG:
- PCB DWG:
- ASSY DWG:
- SCALE:
- SIZE
- B
- CAGE CODE
- FILE NAME
- DWG NO.
- SHEET
- OF
- REV

### Library data of the parts
C34 C36 C38 C40 = Cap: as C4 on sheet PIC Microcontroller; Supplier Part Number 1: 1276-1067-2-ND; Supplier Part Number 2: *; Supplier 1: *; Supplier 2: *; 100pc cost: *; 1pc cost: *; Height: *; value: 1uF
C35 C37 C39 C41 = Cap: as C1 on sheet PIC Microcontroller; Supplier Part Number 1: 445-6899-2-ND; Supplier Part Number 2: *; Supplier 1: *; Supplier 2: *; 100pc cost: *; 1pc cost: *; Height: *; value: 0.1uF
C42 = Cap: CAP CER 4700PF 2KV X7R 1812; Manufacturer: Murata Electronics; Manufacturer Part Number: GR443DR73D472KW01L; Supplier Part Number 1: 490-6106-1-ND; value: 4700pF
C43 C44 = Cap: CAP CER 1000PF 25V X7R 0402; Manufacturer: KEMET; Manufacturer Part Number: C0402C102K3RACTU; Supplier Part Number 1: 399-1031-2-ND; Supplier Part Number 2: *; Supplier 1: *; Supplier 2: *; 100pc cost: *; 1pc cost: *; Height: *; value: 1000pF
D2 D3 = CMP-0085616-1: Diode, TVS, Uni, 3.3 V, 17 Vc, 3300 W, 150 A, SOIC-8; Manufacturer: Littelfuse; Vc: 17V; SizeZ_mm: 1.75; SizeY_mm: 4.9; SizeX_mm: 5.99; AEC Qualified: N; Value: 3.3V; SizeArea_mm2: 29.351; Ipp: 150A; SizeAreaWB_mm2: 55.131; AEC Category: Q101; Ppk: 3.3kW; CompType: TVS; RoHS: Y; Manufacturer Part Number: LC03-3.3BTG; ComponentLink1Description: Datasheet link; Value1: 17V; MountType: SMT; PackageReference: SOIC-8; ComponentLink1URL: https://www.littelfuse.com/~/media/electronics/datasheets/tvs_diode_arrays/littelfuse_tvs_diode_array_lc03_3_3_datasheet.pdf.pdf; VRWM: 3.3V
R18-R21 = R: RES SMD 49.9 OHM 1% 1/16W 0402; Manufacturer: Yageo; Manufacturer Part Number: RC0402FR-0749R9L; Power Rating: 62.5mW; Tolerance: +/-1%; Voltage Rating: NA; Distributor: DigiKey; Value: 49.9; Distributor Art. Nbr.: 311-49.9LRTR-ND; Package: EIA-0402; Price Estim. @ 100pcs: 0.0049; Height: 0.40mm
R22 R23 = R: RES SMD 75 OHM 1% 1/10W 0402; Manufacturer: Panasonic Electronic Components; Manufacturer Part Number: ERJ-2RKF75R0X; Power Rating: 62.5mW; Tolerance: +/-1%; Voltage Rating: NA; Distributor: DigiKey; Value: 75; Distributor Art. Nbr.: P75.0LTR-ND; Package: EIA-0402; Price Estim. @ 100pcs: 0.0049; Height: 0.40mm
T1 = HX1198FNLT: Transformer, 350 uH, SMT; Manufacturer: Pulse Engineering; SymbolCreator: Altium; Value: 350uH; Lp: 350; Ind_H: 0.00035; Green_Lifecycle: Not Set; Green_REACh: Incomplete; SymbolVersion: 2015-05-04; Manufacturer Part Number: HX1198FNLT; MountType: SMT; PackageReference: 12.7x9.09mm; RoHS: Y; ComponentLink1URL: http://productfinder.pulseeng.com/products/datasheets/HX1198FNL.pdf;jsessionid=741BCD40859F1B611B313F549D3EF800; ComponentLink1Description: Datasheet URL; CompType: Transformer; Publisher: Texas Instruments; LatestRevisionDate: 2017-06-21; Supplier 1: Digi-Key; Supplier Part Number 1: 553-2209-1-ND; Supplier 2: Mouser; Supplier Part Number 2: 673-HX1198FNLT; Green_EU RoHS: Incomplete; Green_EU RoHS-2: Incomplete
U5 U6 = ESDS312DBVR: FAMILY OF UNI-DIRECTIONAL SURGE; Alternate Manufacturer: Texas Instruments; SizeX_mm: 2.8; SizeArea_mm2: 8.12; Rating: Catalog; SizeAreaWB_mm2: 14.82; AEC Category: Q200; AEC Qualified: N; CompType: IC; SizeZ_mm: 1.45; SizeY_mm: 2.9; ComponentLink3URL: http://www.ti.com/product/esds312/datasheet; PackageDescription: SOT-23-5; RoHS: Y; ComponentLink1Description: Datasheet Link; Operating Temperature Range: -40 to 125 C; PackageReference: DBV0005A; Digi-Key Part Number: 296-51112-2-ND; ComponentLink1URL: http://www.ti.com/lit/ds/symlink/esds312.pdf; ComponentLink3Description: Online Datasheet; MountType: SMT; ComponentLink2URL: http://www.ti.com/product/esds312; Manufacturer: Texas Instruments; ComponentLink2Description: Product Folder; Manufacturer Part Number: ESDS312DBVR

## Sheet ETH-input.SchDoc: AA Design Challenge
size 431 x 279 mm; Revision: 1.0; SheetNumber: 2; SheetTotal: 4; ProjectName: TRK_GPRS_GNSS_BTLE
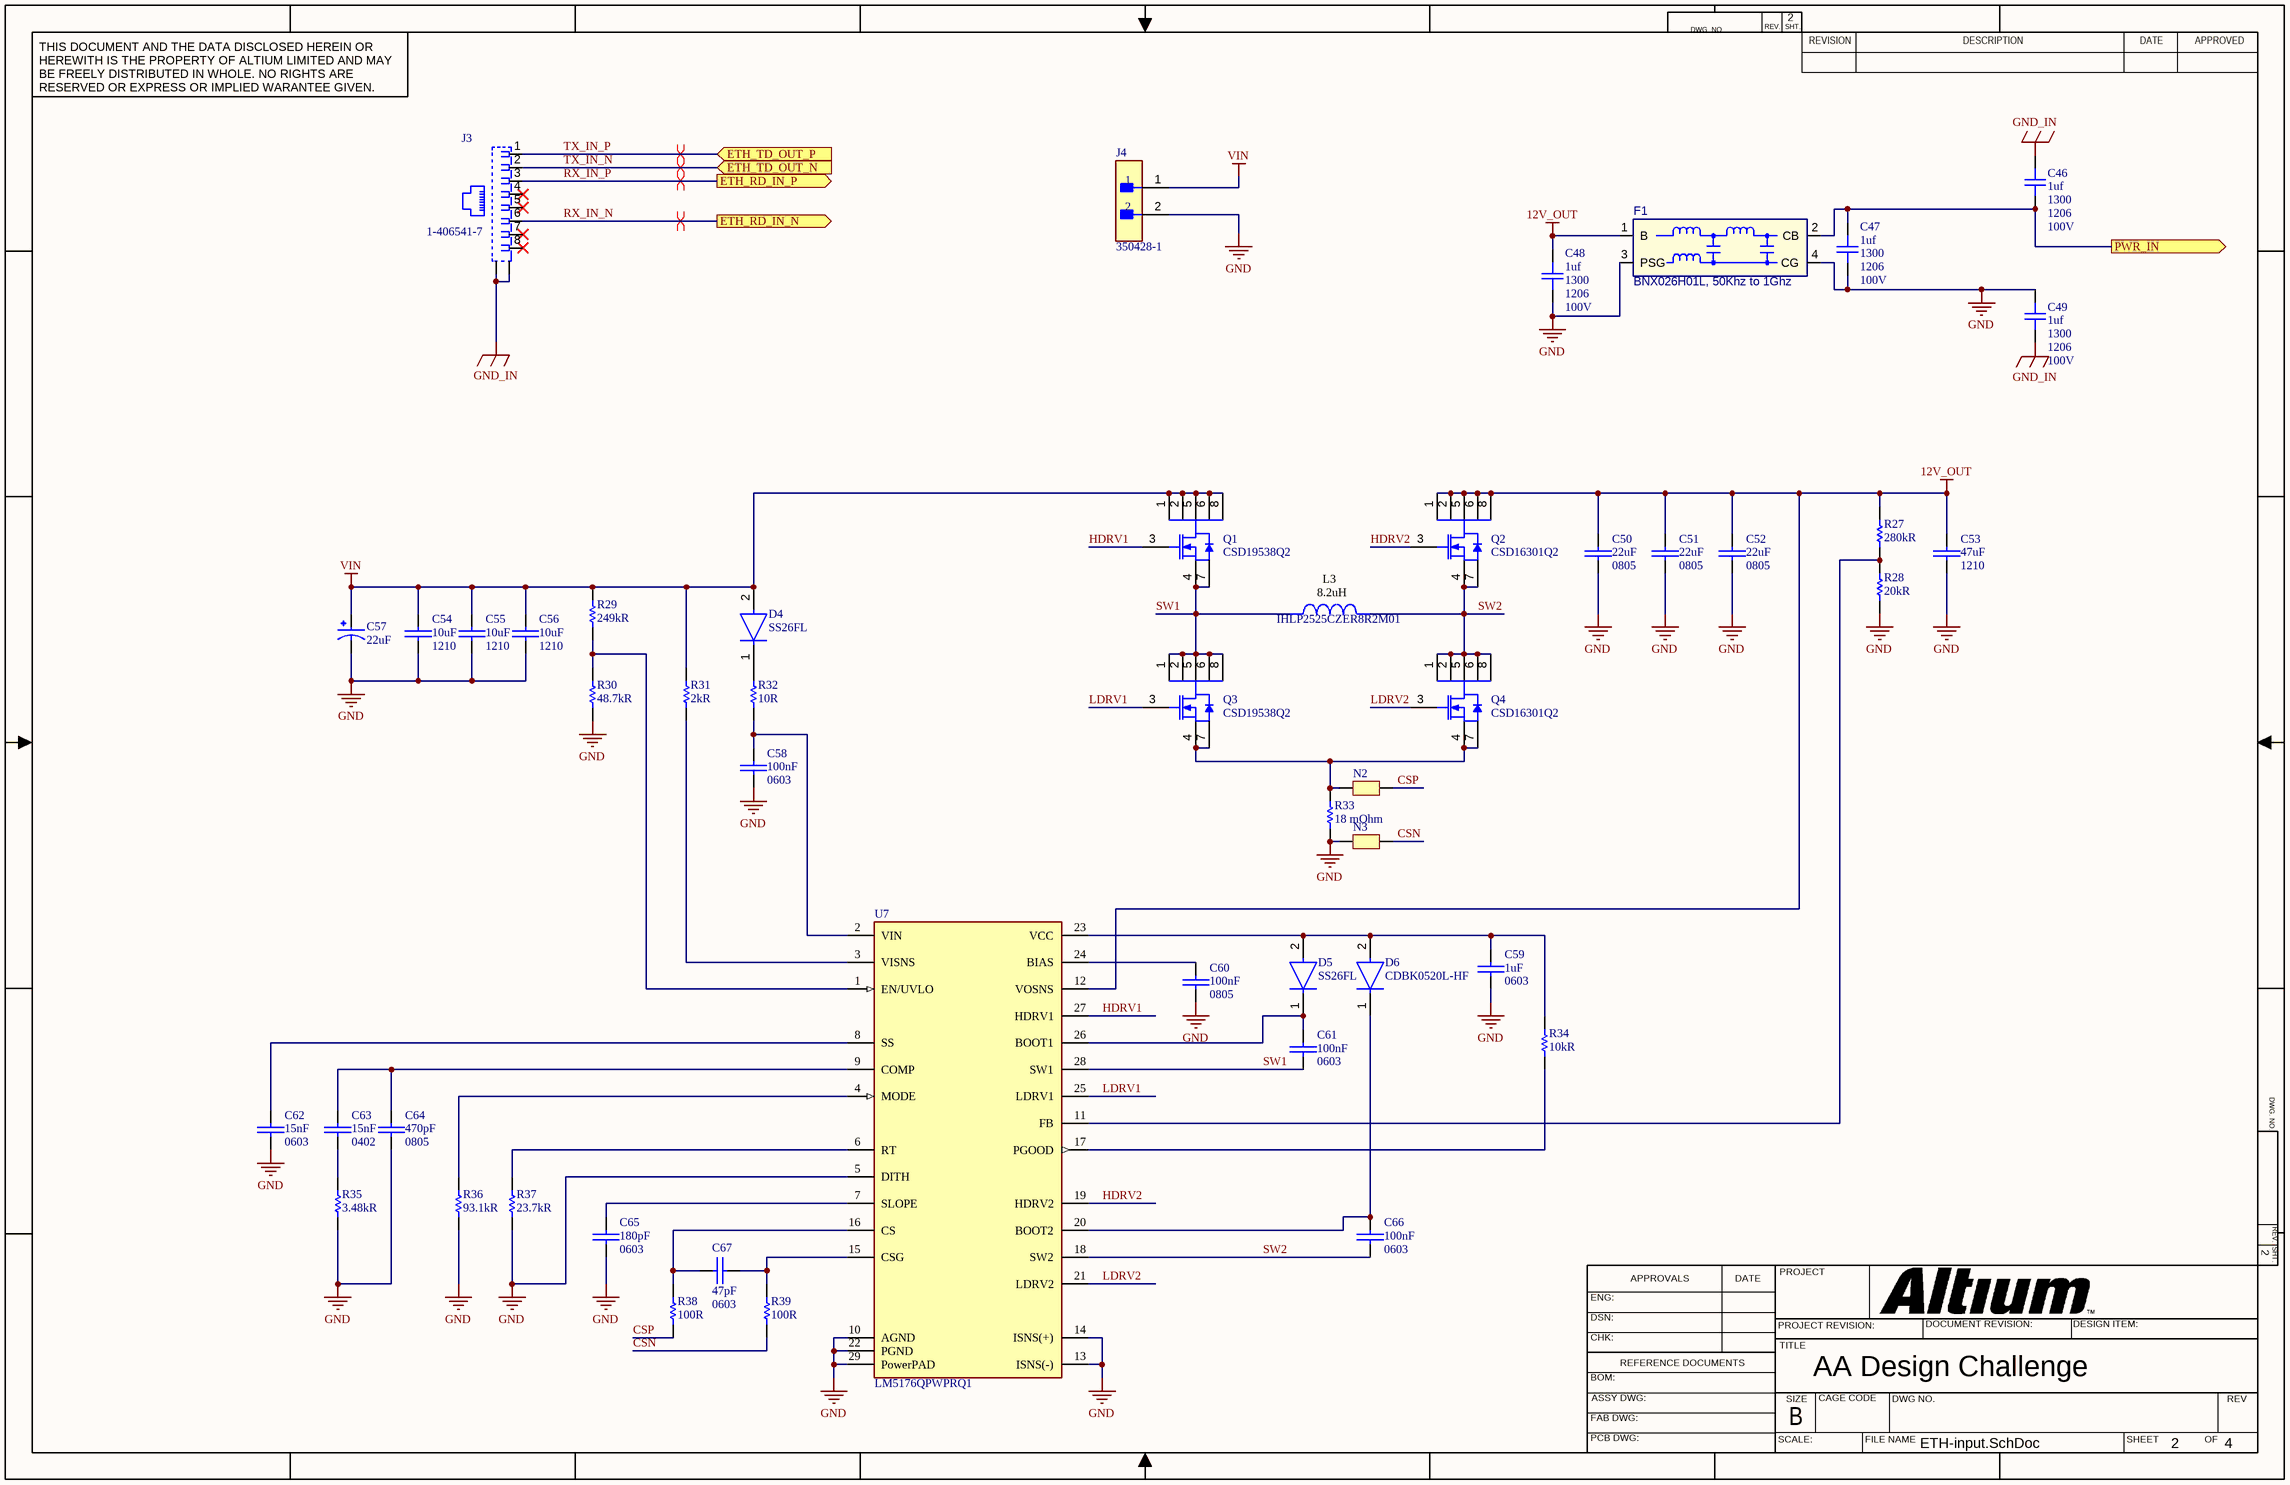
[diagram p4: ETH-input.SchDoc]

### Parts
C46  value 1uf  Case-EIA: 1206  Rated Voltage: 100V  [CAPC3216_IS1206N_3D]  (hidden comment: Capacitor - 1uf 100V 10% X7R 01206)
C47  value 1uf  Case-EIA: 1206  Rated Voltage: 100V  [CAPC3216_IS1206N_3D]  (hidden comment: Capacitor - 1uf 100V 10% X7R 01206)
C48  value 1uf  Case-EIA: 1206  Rated Voltage: 100V  [CAPC3216_IS1206N_3D]  (hidden comment: Capacitor - 1uf 100V 10% X7R 01206)
C49  value 1uf  Case-EIA: 1206  Rated Voltage: 100V  [CAPC3216_IS1206N_3D]  (hidden comment: Capacitor - 1uf 100V 10% X7R 01206)
C50  22uF  Case/Package: 0805  [CAPC2012X145USR]
C51  22uF  Case/Package: 0805  [CAPC2012X145USR]
C52  22uF  Case/Package: 0805  [CAPC2012X145USR]
C53  47uF  Case/Package: 1210  [C1210]
C54  10uF  Case/Package: 1210  [C1210]
C55  10uF  Case/Package: 1210  [C1210]
C56  10uF  Case/Package: 1210  [C1210]
C57  22uF  [CAP_EEEHC1H220XP]
C58  100nF  Case/Package: 0603  [CAP_0603]
C59  1uF  Case/Package: 0603  [CAP_0603]
C60  100nF  Case/Package: 0805  [CAPC2012X145USR]
C61  100nF  Case/Package: 0603  [CAP_0603]
C62  15nF  Case/Package: 0603  [CAP_0603]
C63  15nF  Case/Package: 0402  [CAPC1005X55USR]
C64  470pF  Case/Package: 0805  [CAPC2012X145USR]
C65  180pF  Case/Package: 0603  [CAP_0603]
C66  100nF  Case/Package: 0603  [CAP_0603]
C67  47pF  Case/Package: 0603  [CAP_0603]
D4  SS26FL  [SOD-123F]
D5  SS26FL  [SOD-123F]
D6  CDBK0520L-HF  [SOD-123F _CDBK]
F1  value BNX026H01L, 50Khz to 1Ghz  [1359]  (hidden comment: BNX026)
J3  1-406541-7  [TE_1-406507-5]
J4  350428-1  [FP-350428-1-MFG]
L3  8.2uH  Manufacturer Part Number: IHLP2525CZER8R2M01  [INDM686X647X300N]
N2  NT  [Net Tie 10mil]  (value not drawn)  (net tie, no BOM)
N3  NT  [Net Tie 10mil]  (value not drawn)  (net tie, no BOM)
Q1  CSD19538Q2  [TRANS_6WSON_2X2]
Q2  CSD16301Q2  [TRANS_6WSON_2X2]
Q3  CSD19538Q2  [TRANS_6WSON_2X2]
Q4  CSD16301Q2  [TRANS_6WSON_2X2]
R27  280kR  [R0603]
R28  20kR  [R0603]
R29  249kR  [RESC0603X26N]
R30  48.7kR  [RESC1005X40USR]
R31  2kR  [R0603]
R32  10R  [R0603]
R33  18 mOhm  [RES 1206N - 71]
R34  10kR  [R0603]
R35  3.48kR  [RESC1005X40USR]
R36  93.1kR  [R0603]
R37  23.7kR  [RESC0603X26N]
R38  100R  [R0603]
R39  100R  [R0603]
U7  LM5176QPWPRQ1  [IC_LM5176QPWPRQ1]

### Ports
ETH_RD_IN_N (out), ETH_RD_IN_P (out), ETH_TD_OUT_N (in), ETH_TD_OUT_P (in), PWR_IN (out)

### Nets
12V_OUT: C48.1 C50.1 C51.1 C52.1 C53.1 F1.1(B) Q2.1(DRAIN) Q2.2(DRAIN) Q2.5(DRAIN) Q2.6(DRAIN) Q2.8(DRAIN) R27.2 U7.12(VOSNS)
GND: C47.2 C48.2 C49.2 C50.2 C51.2 C52.2 C53.2 C54.2 C55.2 C56.2 C57.2 C58.2 C59.2 C60.2 C62.2 C64.2 C65.2 F1.3(PSG) F1.4(CG) J4.2 N3.1 R28.1 R30.1 R33.1 R35.1 R36.1 R37.1 U7.5(DITH) U7.10(AGND) U7.13(ISNS(-)) U7.14(ISNS(+)) U7.22(PGND) U7.29(PowerPAD)
GND_IN: C46.1 C49.1 J3.9(S1) J3.10(S2)
PWN_IN: C46.2 C47.1 F1.2(CB) ; port PWR_IN
VIN: C54.1 C55.1 C56.1 C57.1 D4.2(A) J4.1 Q1.1(DRAIN) Q1.2(DRAIN) Q1.5(DRAIN) Q1.6(DRAIN) Q1.8(DRAIN) R29.2 R31.2
CSN: N3.2 R39.1
CSP: N2.2 R38.1
HDRV1: Q1.3(GATE) U7.27(HDRV1)
HDRV2: Q2.3(GATE) U7.19(HDRV2)
LDRV1: Q3.3(GATE) U7.25(LDRV1)
LDRV2: Q4.3(GATE) U7.21(LDRV2)
RX_IN_N: J3.6 ; port ETH_RD_IN_N
RX_IN_P: J3.3 ; port ETH_RD_IN_P
SW1: C61.2 L3.1 Q1.4(SOURCE) Q1.7(SOURCE) Q3.1(DRAIN) Q3.2(DRAIN) Q3.5(DRAIN) Q3.6(DRAIN) Q3.8(DRAIN) U7.28(SW1)
SW2: C66.2 L3.2 Q2.4(SOURCE) Q2.7(SOURCE) Q4.1(DRAIN) Q4.2(DRAIN) Q4.5(DRAIN) Q4.6(DRAIN) Q4.8(DRAIN) U7.18(SW2)
TX_IN_N: J3.2 ; port ETH_TD_OUT_N
TX_IN_P: J3.1 ; port ETH_TD_OUT_P
NetC58_1: C58.1 R32.1 U7.2(VIN)
NetC59_1: C59.1 D5.2(A) D6.2(A) R34.2 U7.23(VCC)
NetC60_1: C60.1 U7.24(BIAS)
NetC61_1: C61.1 D5.1(C) U7.26(BOOT1)
NetC62_1: C62.1 U7.8(SS)
NetC63_1: C63.1 C64.1 U7.9(COMP)
NetC63_2: C63.2 R35.2
NetC65_1: C65.1 U7.7(SLOPE)
NetC66_1: C66.1 D6.1(C) U7.20(BOOT2)
NetC67_1: C67.1 R38.2 U7.16(CS)
NetC67_2: C67.2 R39.2 U7.15(CSG)
NetD4_1: D4.1(C) R32.2
NetN2_1: N2.1 Q3.4(SOURCE) Q3.7(SOURCE) Q4.4(SOURCE) Q4.7(SOURCE) R33.2
NetR27_1: R27.1 R28.2 U7.11(FB)
NetR29_1: R29.1 R30.2 U7.1(EN/UVLO)
NetR31_1: R31.1 U7.3(VISNS)
NetR34_1: R34.1 U7.17(PGOOD)
NetR36_2: R36.2 U7.4(MODE)
NetR37_2: R37.2 U7.6(RT)

Not connected (* = marked no-connect by the designer): J3 4* 5* 7* 8*

### Layout directives
differential pair: RX_IN_N, RX_IN_P, TX_IN_N, TX_IN_P

### Notes on the sheet
- DWG. NO.
- REV.
- SHT.
- THIS DOCUMENT AND THE DATA DISCLOSED HEREIN OR HEREWITH IS THE PROPERTY OF ALTIUM LIMITED AND MAY BE FREELY DISTRIBUTED IN WHOLE. NO RIGHTS ARE RESERVED OR EXPRESS OR IMPLIED WARANTEE GIVEN.
- REVISION
- DESCRIPTION
- DATE
- APPROVED
- ENG:
- APPROVALS
- PROJECT
- DSN:
- CHK:
- REFERENCE DOCUMENTS
- PROJECT REVISION:
- TITLE
- DOCUMENT REVISION:
- DESIGN ITEM:
- BOM:
- FAB DWG:
- PCB DWG:
- ASSY DWG:
- SCALE:
- SIZE
- B
- CAGE CODE
- FILE NAME
- DWG NO.
- SHEET
- OF
- REV